# EAGLE schematic v3 (EAGLE 7.2.0)
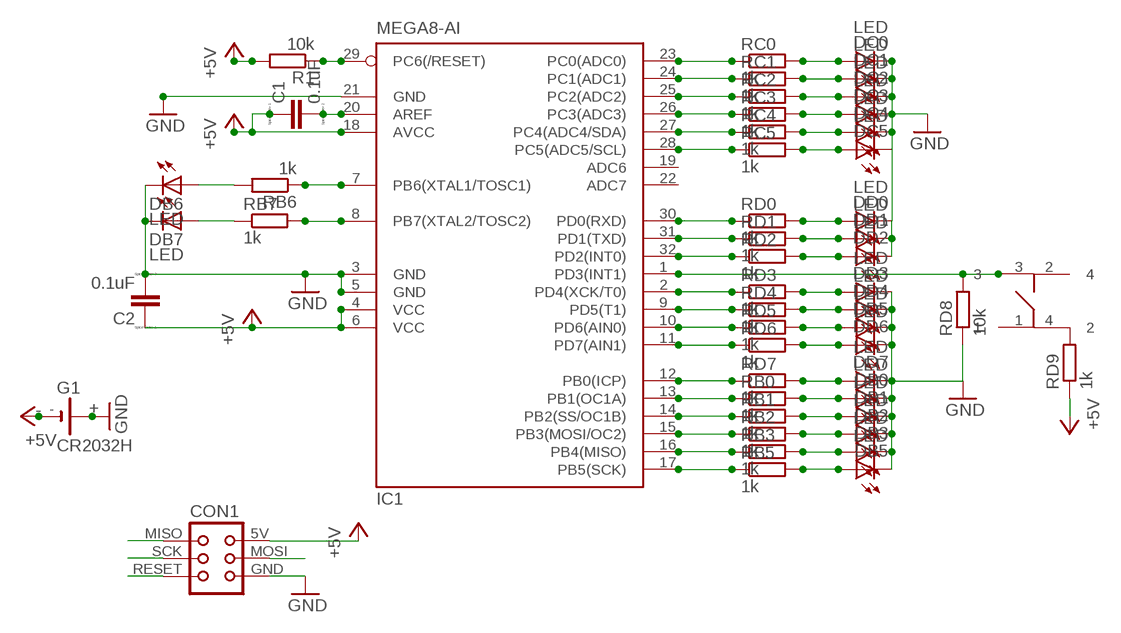
[diagram p0: schematic, sheet 1]

## Parts
C1  0.1uF  CC0402  [C0402]
C2  0.1uF  CC0402  [C0402]
CON1  TINYISPT  [TC2030-MCP-NL]
DB0  LED  [D0402]
DB1  LED  [D0402]
DB2  LED  [D0402]
DB3  LED  [D0402]
DB5  LED  [D0402]
DB6  LED  [D0402]
DB7  LED  [D0402]
DC0  LED  [D0402]
DC1  LED  [D0402]
DC2  LED  [D0402]
DC3  LED  [D0402]
DC4  LED  [D0402]
DC5  LED  [D0402]
DD0  LED  [D0402]
DD1  LED  [D0402]
DD2  LED  [D0402]
DD3  LED  [D0402]
DD4  LED  [D0402]
DD5  LED  [D0402]
DD6  LED  [D0402]
DD7  LED  [D0402]
G1  CR2032H  [CR2032H]
IC1  MEGA8-AI  [TQFP32-08]
R1  10k  R-EU_R0402  [R0402]
RB0  1k  R-EU_R0402  [R0402]
RB1  1k  R-EU_R0402  [R0402]
RB2  1k  R-EU_R0402  [R0402]
RB3  1k  R-EU_R0402  [R0402]
RB5  1k  R-EU_R0402  [R0402]
RB6  1k  R-EU_R0402  [R0402]
RB7  1k  R-EU_R0402  [R0402]
RC0  1k  R-EU_R0402  [R0402]
RC1  1k  R-EU_R0402  [R0402]
RC2  1k  R-EU_R0402  [R0402]
RC3  1k  R-EU_R0402  [R0402]
RC4  1k  R-EU_R0402  [R0402]
RC5  1k  R-EU_R0402  [R0402]
RD0  1k  R-EU_R0402  [R0402]
RD1  1k  R-EU_R0402  [R0402]
RD2  1k  R-EU_R0402  [R0402]
RD3  1k  R-EU_R0402  [R0402]
RD4  1k  R-EU_R0402  [R0402]
RD5  1k  R-EU_R0402  [R0402]
RD6  1k  R-EU_R0402  [R0402]
RD7  1k  R-EU_R0402  [R0402]
RD8  10k  R-EU_R0402  [R0402]
RD9  1k  R-EU_R0402  [R0402]
U$2  TEUCH4MM  [TEUCH4MM]

## Nets
+5V [power]: C1.1 C2.1 CON1.5V(VCC) G1.- IC1.4(VCC) IC1.6(VCC) IC1.18(AVCC) R1.2 RD9.1
GND [power]: C2.2 CON1.GND DB0.C DB1.C DB2.C DB3.C DB5.C DB6.C DB7.C DC0.C DC1.C DC2.C DC3.C DC4.C DC5.C DD0.C DD1.C DD2.C DD3.C DD4.C DD5.C DD6.C DD7.C G1.+ IC1.3(GND) IC1.5(GND) IC1.21(GND) RD8.1
MISO: CON1.MISO
MOSI: CON1.MOSI
N$1: IC1.7(PB6(XTAL1/TOSC1)) RB6.1
N$2: IC1.24(PC1(ADC1)) RC1.1
N$3: IC1.23(PC0(ADC0)) RC0.1
N$4: C1.2 IC1.20(AREF)
N$5: IC1.26(PC3(ADC3)) RC3.1
N$6: IC1.25(PC2(ADC2)) RC2.1
N$7: IC1.27(PC4(ADC4/SDA)) RC4.1
N$8: IC1.28(PC5(ADC5/SCL)) RC5.1
N$9: IC1.30(PD0(RXD)) RD0.1
N$10: IC1.31(PD1(TXD)) RD1.1
N$11: IC1.17(PB5(SCK)) RB5.1
N$12: IC1.32(PD2(INT0)) RD2.1
N$13: IC1.16(PB4(MISO)) RB3.1
N$14: IC1.15(PB3(MOSI/OC2)) RB2.1
N$15: IC1.14(PB2(SS/OC1B)) RB1.1
N$16: IC1.13(PB1(OC1A)) RB0.1
N$17: IC1.12(PB0(ICP)) RD7.1
N$18: IC1.11(PD7(AIN1)) RD6.1
N$19: IC1.10(PD6(AIN0)) RD5.1
N$20: IC1.9(PD5(T1)) RD4.1
N$21: IC1.8(PB7(XTAL2/TOSC2)) RB7.2
N$22: U$2.1 U$2.4
N$23: U$2.2 U$2.3
N$24: DB7.A RB7.1
N$25: DC0.A RC0.2
N$26: DC1.A RC1.2
N$27: DC2.A RC2.2
N$28: DC3.A RC3.2
N$29: DC4.A RC4.2
N$30: DC5.A RC5.2
N$31: DD0.A RD0.2
N$32: DD1.A RD1.2
N$33: DD2.A RD2.2
N$34: DD3.A RD3.2
N$35: DD4.A RD4.2
N$36: DD5.A RD5.2
N$37: DD6.A RD6.2
N$38: DD7.A RD7.2
N$39: DB0.A RB0.2
N$40: DB1.A RB1.2
N$41: DB2.A RB2.2
N$42: DB3.A RB3.2
N$43: IC1.2(PD4(XCK/T0)) RD3.1
N$44: DB6.A RB6.2
N$45: IC1.1(PD3(INT1)) RD8.2
N$46: DB5.A RB5.2
RESET: CON1.RESET IC1.29(PC6(/RESET)) R1.1
SCK: CON1.SCK
Unconnected: IC1.19(ADC6) IC1.22(ADC7) RD9.2

## Library data of the parts
C1 C2 = eagle-ltspice:C: CAPACITOR, European symbol; SPICEMODEL: NONE; SPICEPREFIX: C
CON1 = lpatiny:TINYISP: CONNECTOR
DB0 DB1-DB3 DB5-DB7 DC0 DC1-DC5 DD0 DD1-DD7 = florian:LED: LED - LUMILED® LXK2-PW12-R00, LXK2-PW12-S00, LXK2-PW14-U00, LXK2-PW14-V00 LXK2-PM12-R00, LXK2-PM12-S00, LXK2-PM14-U00 LXK2-PE12-Q00, LXK2-PE12-R00, LXK2-PE12-S00, LXK2-PE14-T00, LXK2-PE14-U00 LXK2-PB12-K00, LXK2-PB12-L00, LXK2-PB12-M00, LXK2-PB14-N00, LXK2-PB14-P00, LXK2-PB14-Q00 LXK2-PR12-L00, LXK2-PR12-M00, LXK2-PR14-Q00, LXK2-PR14-R00 LXK2-PD12-Q00, LXK2-PD12-R00, LXK2-PD12-S00 LXK2-PH12-R00, LXK2-PH12-S00 LXK2-PL12-P00, LXK2-PL12-Q00, LXK2-PL12-R00 Source: www.luxeon.com
G1 = florian:CR2032H: LI BATTERY Varta
IC1 = atmel:MEGA8: MICROCONTROLLER 8 Kbytes FLASH, 1 kbytes SRAM, 512 bytes EEPROM, USART, 6-channel 10 bit ADC, 2-channel 8 bit ADC Pin compatible with Atmega48, ATMega88, ATMega168 Source: avr.lbr; MPN: ATMEGA8-16AU; OC_FARNELL: 9171371; OC_NEWARK: 73M8863
R1 RB0 RB1-RB3 RB5-RB7 RC0 RC1-RC5 RD0 RD1-RD9 = resistor:R-EU_: RESISTOR, European symbol
U$2 = florian:TEUCH4MM

## Net classes
0 default: width 0.203 mm
1 power: width 0.254 mm